# EAGLE design bbb-cc2520_a (EAGLE 6.6.0)
AUTHOR: Neal Jackson; REV: A; TITLE: BBB + CC2520

## Sheet 1 of 2
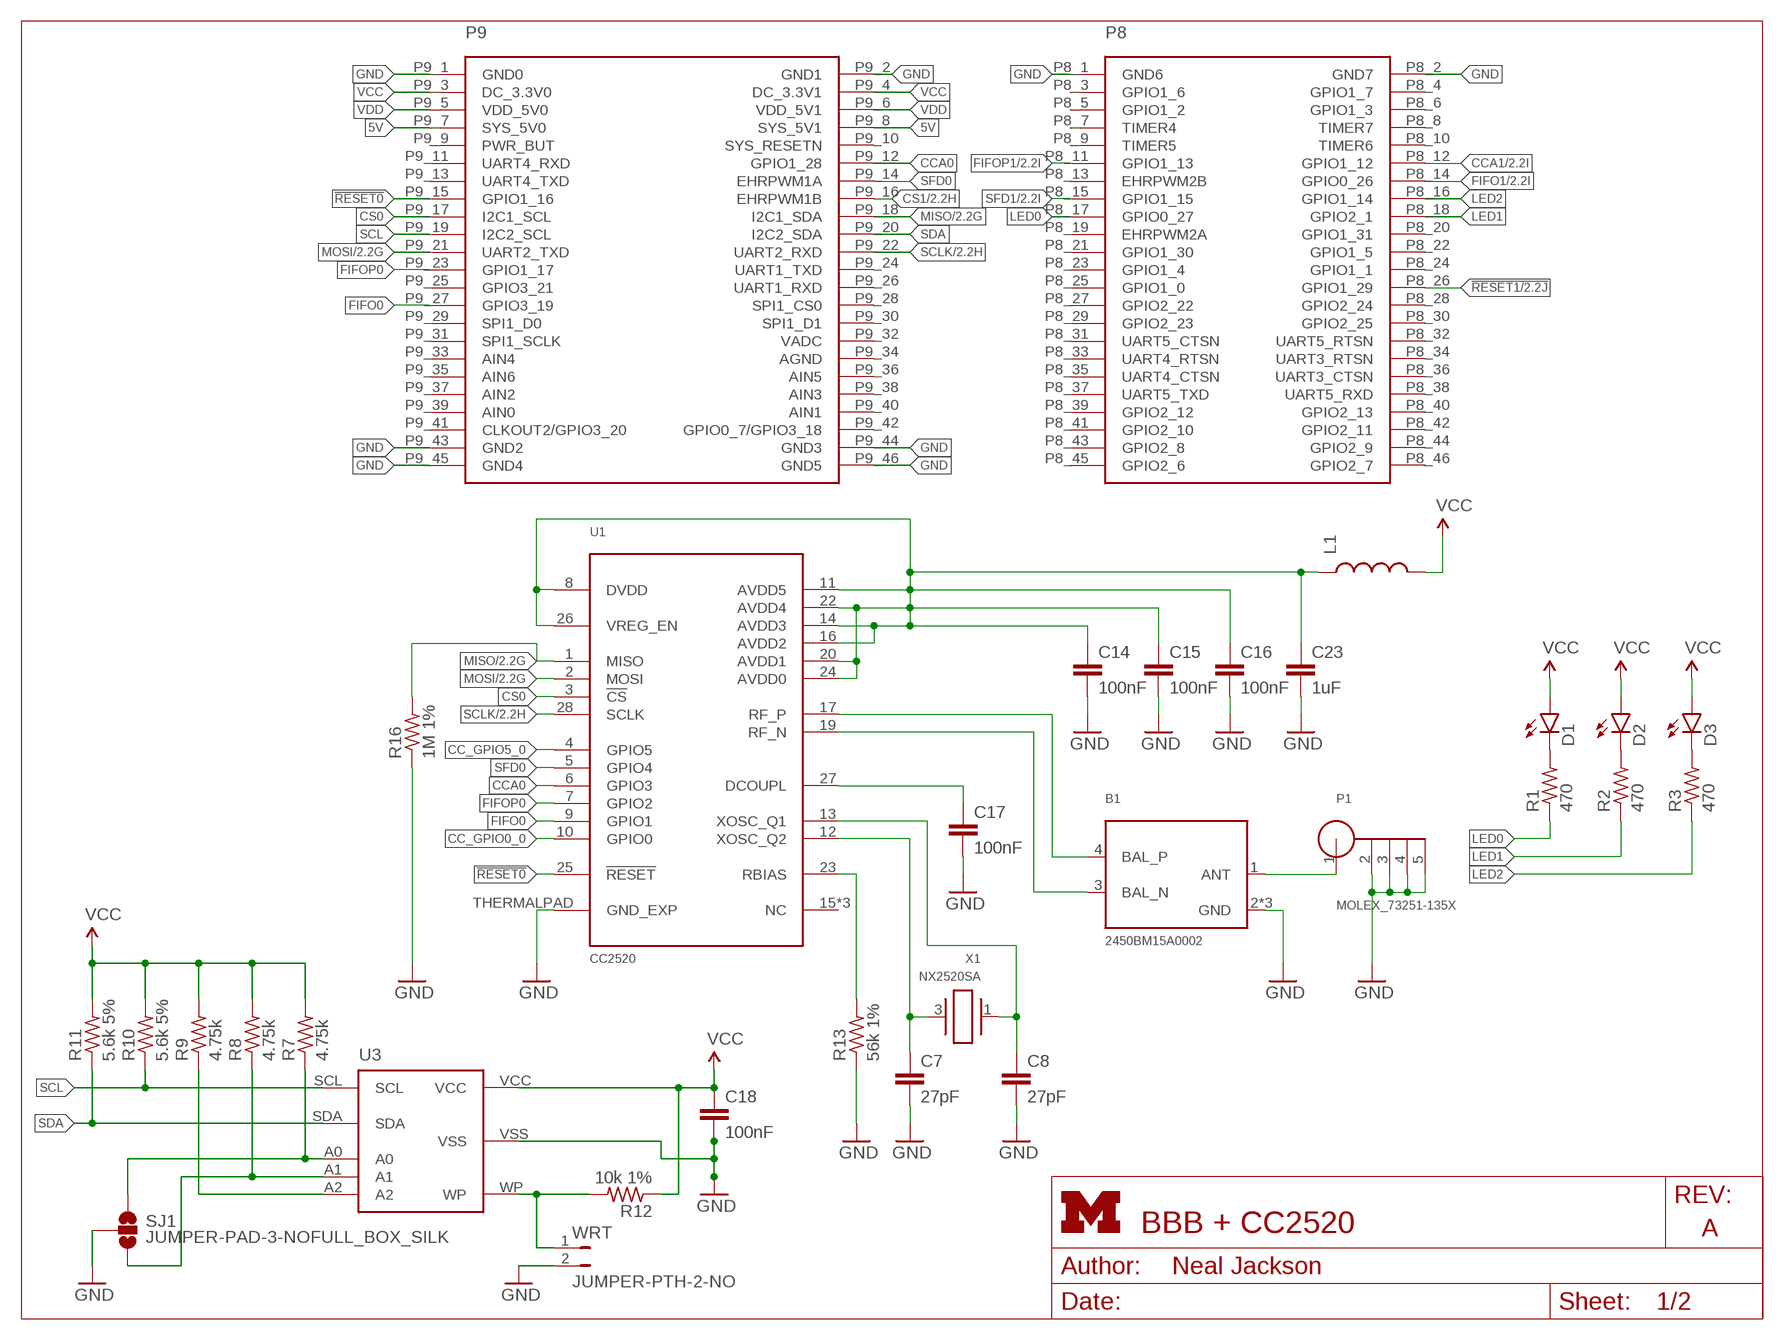
[diagram p0: schematic, sheet 1]
FRAME1 (LETTER_L): HEIGHT: 8.5in; WIDTH: 11in

### Parts
B1  2450BM15A0002  [2450BM]
C7  27pF  C-EUC0402  [C0402]
C8  27pF  C-EUC0402  [C0402]
C14  100nF  C-EUC0402  [C0402]
C15  100nF  C-EUC0402  [C0402]
C16  100nF  C-EUC0402  [C0402]
C17  100nF  C-EUC0402  [C0402]
C18  100nF  C-EUC0402  [C0402]
C23  1uF  C-EUC0603  [C0603]
D1  LED0603  [LED-0603]
D2  LED0603  [LED-0603]
D3  LED0603  [LED-0603]
L1  INDUCTOR0603  [0603]
P1  MOLEX_73251-135X  [SMA-J/PCB]
P9/P8  BBB_HEADERS  [BBB_HEADERS]
R1  470  R-US_R0402  [R0402]
R2  470  R-US_R0402  [R0402]
R3  470  R-US_R0402  [R0402]
R7  4.75k  R-US_R0402  [R0402]
R8  4.75k  R-US_R0402  [R0402]
R9  4.75k  R-US_R0402  [R0402]
R10  5.6k 5%  R-US_R0402  [R0402]
R11  5.6k 5%  R-US_R0402  [R0402]
R12  10k 1%  R-US_R0402  [R0402]
R13  56k 1%  R-US_R0402  [R0402]
R16  1M 1%  R-US_R0402  [R0402]
SJ1  JUMPER-PAD-3-NOFULL_BOX_SILK  [PAD-JUMPER-3-NO_YES_SILK_FULL_BOX]
U1  CC2520  [S-PVQFN-N28]
U3  CAT24C256WI-GT3  [CAT24C256WI-GT3]
WRT  JUMPER-PTH-2-NO  [PTH-JUMPER-2-NO_NO_SILK]
X1  NX2520SA  [NX2520SA]

### Nets
5V: P9/P8.P9_7(SYS_5V0) P9/P8.P9_8(SYS_5V1)
!RESET0: P9/P8.P9_15(GPIO1_16) U1.25(!RESET)
!RESET1: P9/P8.P8_26(GPIO1_29) ; also sheet 2
CC_GPIO0_0: U1.10(GPIO0)
CC_GPIO5_0: U1.4(GPIO5)
CCA0: P9/P8.P9_12(GPIO1_28) U1.6(GPIO3)
CCA1: P9/P8.P8_12(GPIO1_12) ; also sheet 2
CS0: P9/P8.P9_17(I2C1_SCL) U1.3(!CS)
CS1: P9/P8.P9_16(EHRPWM1B) ; also sheet 2
FIFO0: P9/P8.P9_27(GPIO3_19) U1.9(GPIO1)
FIFO1: P9/P8.P8_14(GPIO0_26) ; also sheet 2
FIFOP0: P9/P8.P9_23(GPIO1_17) U1.7(GPIO2)
FIFOP1: P9/P8.P8_11(GPIO1_13) ; also sheet 2
GND: B1.2(GND) B1.5(GND) B1.6(GND) C7.2 C8.2 C14.2 C15.2 C16.2 C17.2 C18.2 C23.2 P1.2 P1.3 P1.4 P1.5 P9/P8.P8_1(GND6) P9/P8.P8_2(GND7) P9/P8.P9_1(GND0) P9/P8.P9_2(GND1) P9/P8.P9_43(GND2) P9/P8.P9_44(GND3) P9/P8.P9_45(GND4) P9/P8.P9_46(GND5) R13.1 R16.1 SJ1.2 U1.THERMALPAD(GND_EXP) U3.VSS WRT.2 ; also sheet 2
LED0: P9/P8.P8_17(GPIO0_27) R1.1
LED1: P9/P8.P8_18(GPIO2_1) R2.1
LED2: P9/P8.P8_16(GPIO1_14) R3.1
MISO: P9/P8.P9_18(I2C1_SDA) R16.2 U1.1(MISO) ; also sheet 2
MOSI: P9/P8.P9_21(UART2_TXD) U1.2(MOSI) ; also sheet 2
N$1: D1.C R1.2
N$2: D2.C R2.2
N$3: D3.C R3.2
N$5: C14.1 C15.1 C16.1 C23.1 L1.1 U1.8(DVDD) U1.11(AVDD5) U1.14(AVDD3) U1.16(AVDD2) U1.20(AVDD1) U1.22(AVDD4) U1.24(AVDD0) U1.26(VREG_EN)
N$7: B1.1(ANT) P1.1
N$11: C8.1 U1.13(XOSC_Q1) X1.1
N$12: C17.1 U1.27(DCOUPL)
N$13: C7.1 U1.12(XOSC_Q2) X1.3
N$14: R13.2 U1.23(RBIAS)
N$29: R7.1 SJ1.1 U3.A0
N$30: R8.1 SJ1.3 U3.A1
N$31: R12.2 U3.WP WRT.1
N$32: R9.1 U3.A2
RF_N: B1.3(BAL_N) U1.19(RF_N)
RF_P: B1.4(BAL_P) U1.17(RF_P)
SCL: P9/P8.P9_19(I2C2_SCL) R10.1 U3.SCL
SCLK: P9/P8.P9_22(UART2_RXD) U1.28(SCLK) ; also sheet 2
SDA: P9/P8.P9_20(I2C2_SDA) R11.1 U3.SDA
SFD0: P9/P8.P9_14(EHRPWM1A) U1.5(GPIO4)
SFD1: P9/P8.P8_15(GPIO1_15) ; also sheet 2
VCC: C18.1 D1.A D2.A D3.A L1.2 P9/P8.P9_3(DC_3.3V0) P9/P8.P9_4(DC_3.3V1) R7.2 R8.2 R9.2 R10.2 R11.2 R12.1 U3.VCC ; also sheet 2
VDD: P9/P8.P9_5(VDD_5V0) P9/P8.P9_6(VDD_5V1)
Unconnected: P9/P8.P8_3(GPIO1_6) P9/P8.P8_4(GPIO1_7) P9/P8.P8_5(GPIO1_2) P9/P8.P8_6(GPIO1_3) P9/P8.P8_7(TIMER4) P9/P8.P8_8(TIMER7) P9/P8.P8_9(TIMER5) P9/P8.P8_10(TIMER6) P9/P8.P8_13(EHRPWM2B) P9/P8.P8_19(EHRPWM2A) P9/P8.P8_20(GPIO1_31) P9/P8.P8_21(GPIO1_30) P9/P8.P8_22(GPIO1_5) P9/P8.P8_23(GPIO1_4) P9/P8.P8_24(GPIO1_1) P9/P8.P8_25(GPIO1_0) P9/P8.P8_27(GPIO2_22) P9/P8.P8_28(GPIO2_24) P9/P8.P8_29(GPIO2_23) P9/P8.P8_30(GPIO2_25) P9/P8.P8_31(UART5_CTSN) P9/P8.P8_32(UART5_RTSN) P9/P8.P8_33(UART4_RTSN) P9/P8.P8_34(UART3_RTSN) P9/P8.P8_35(UART4_CTSN) P9/P8.P8_36(UART3_CTSN) P9/P8.P8_37(UART5_TXD) P9/P8.P8_38(UART5_RXD) P9/P8.P8_39(GPIO2_12) P9/P8.P8_40(GPIO2_13) P9/P8.P8_41(GPIO2_10) P9/P8.P8_42(GPIO2_11) P9/P8.P8_43(GPIO2_8) P9/P8.P8_44(GPIO2_9) P9/P8.P8_45(GPIO2_6) P9/P8.P8_46(GPIO2_7) P9/P8.P9_9(PWR_BUT) P9/P8.P9_10(SYS_RESETN) P9/P8.P9_11(UART4_RXD) P9/P8.P9_13(UART4_TXD) P9/P8.P9_24(UART1_TXD) P9/P8.P9_25(GPIO3_21) P9/P8.P9_26(UART1_RXD) P9/P8.P9_28(SPI1_CS0) P9/P8.P9_29(SPI1_D0) P9/P8.P9_30(SPI1_D1) P9/P8.P9_31(SPI1_SCLK) P9/P8.P9_32(VADC) P9/P8.P9_33(AIN4) P9/P8.P9_34(AGND) P9/P8.P9_35(AIN6) P9/P8.P9_36(AIN5) P9/P8.P9_37(AIN2) P9/P8.P9_38(AIN3) P9/P8.P9_39(AIN0) P9/P8.P9_40(AIN1) P9/P8.P9_41(CLKOUT2/GPIO3_20) P9/P8.P9_42(GPIO0_7/GPIO3_18) U1.15(NC) U1.18(NC) U1.21(NC)

## Sheet 2 of 2
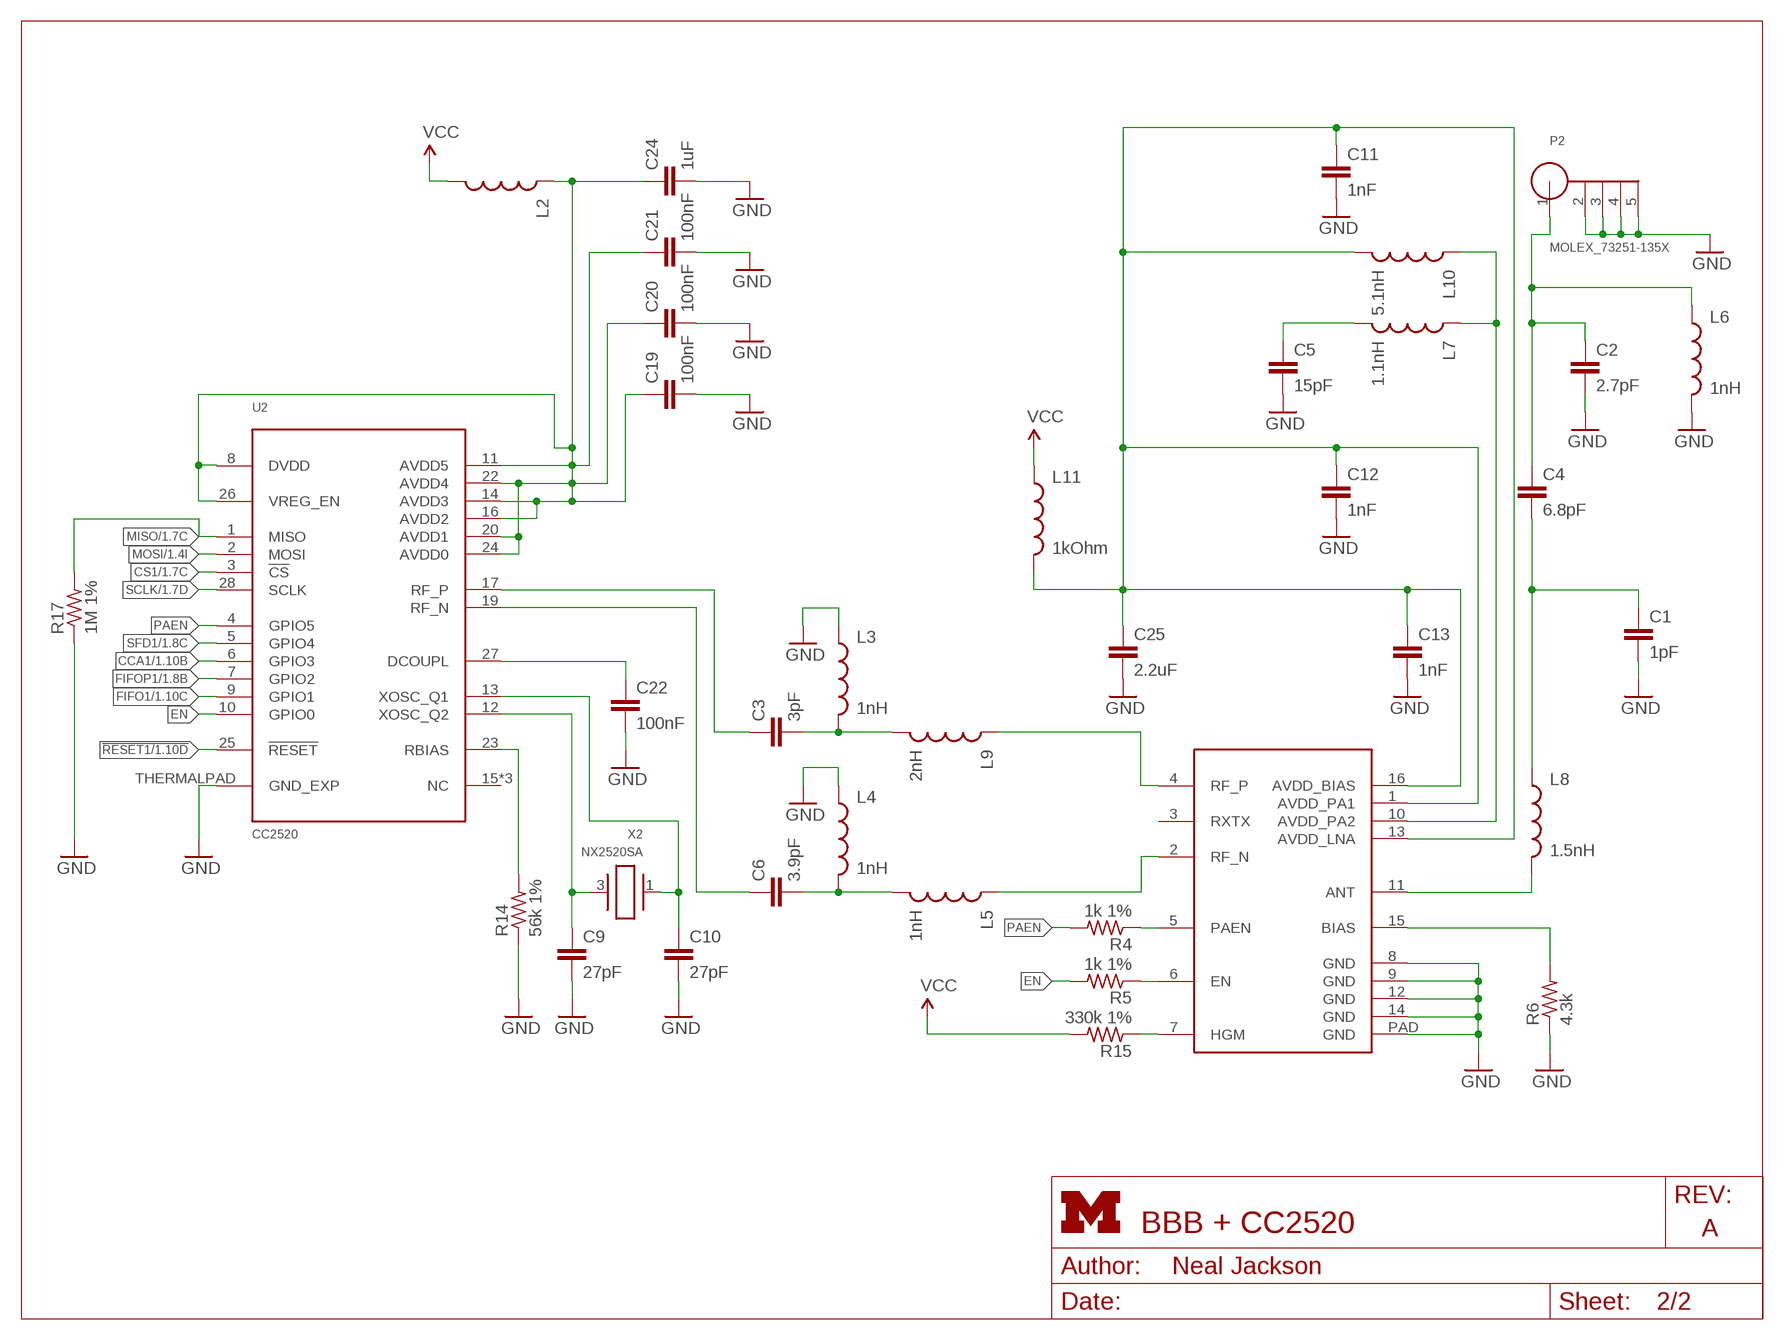
[diagram p1: schematic, sheet 2]
FRAME3 (LETTER_L): HEIGHT: 8.5in; WIDTH: 11in

### Parts
C1  1pF  C-EUC0402  [C0402]
C2  2.7pF  C-EUC0402  [C0402]
C3  3pF  C-EUC0402  [C0402]
C4  6.8pF  C-EUC0402  [C0402]
C5  15pF  C-EUC0402  [C0402]
C6  3.9pF  C-EUC0402  [C0402]
C9  27pF  C-EUC0402  [C0402]
C10  27pF  C-EUC0402  [C0402]
C11  1nF  C-EUC0402  [C0402]
C12  1nF  C-EUC0402  [C0402]
C13  1nF  C-EUC0402  [C0402]
C19  100nF  C-EUC0402  [C0402]
C20  100nF  C-EUC0402  [C0402]
C21  100nF  C-EUC0402  [C0402]
C22  100nF  C-EUC0402  [C0402]
C24  1uF  C-EUC0603  [C0603]
C25  2.2uF  C-EUC0402  [C0402]
L2  INDUCTOR0603  [0603]
L3  1nH  INDUCTOR0402  [C0402]
L4  1nH  INDUCTOR0402  [C0402]
L5  1nH  INDUCTOR0402  [C0402]
L6  1nH  INDUCTOR0402  [C0402]
L7  1.1nH  INDUCTOR0402  [C0402]
L8  1.5nH  INDUCTOR0402  [C0402]
L9  2nH  INDUCTOR0402  [C0402]
L10  5.1nH  INDUCTOR0402  [C0402]
L11  1kOhm  INDUCTOR0402  [C0402]
P2  MOLEX_73251-135X  [SMA-J/PCB]
R4  1k 1%  R-US_R0402  [R0402]
R5  1k 1%  R-US_R0402  [R0402]
R6  4.3k  R-US_R0402  [R0402]
R14  56k 1%  R-US_R0402  [R0402]
R15  330k 1%  R-US_R0402  [R0402]
R17  1M 1%  R-US_R0402  [R0402]
U2  CC2520  [S-PVQFN-N28]
U4  CC2591  [PVQFN-16]
X2  NX2520SA  [NX2520SA]

### Nets
!RESET1: U2.25(!RESET) ; also sheet 1
CCA1: U2.6(GPIO3) ; also sheet 1
CS1: U2.3(!CS) ; also sheet 1
EN: R5.2 U2.10(GPIO0)
FIFO1: U2.9(GPIO1) ; also sheet 1
FIFOP1: U2.7(GPIO2) ; also sheet 1
GND: C1.2 C2.2 C5.2 C9.2 C10.2 C11.2 C12.2 C13.2 C19.2 C20.2 C21.2 C22.2 C24.2 C25.2 L3.1 L4.1 L6.2 P2.2 P2.3 P2.4 P2.5 R6.1 R14.1 R17.1 U2.THERMALPAD(GND_EXP) U4.8(GND) U4.9(GND) U4.12(GND) U4.14(GND) U4.PAD(GND) ; also sheet 1
MISO: R17.2 U2.1(MISO) ; also sheet 1
MOSI: U2.2(MOSI) ; also sheet 1
N$44: L9.1 U4.4(RF_P)
N$45: L5.1 U4.2(RF_N)
N$46: C6.2 L4.2 L5.2
N$47: C3.2 L3.2 L9.2
N$48: L7.1 L10.1 U4.10(AVDD_PA2)
N$49: C11.1 C12.1 C13.1 C25.1 L10.2 L11.2 U4.1(AVDD_PA1) U4.13(AVDD_LNA) U4.16(AVDD_BIAS)
N$50: C5.1 L7.2
N$51: L8.2 U4.11(ANT)
N$52: C2.1 C4.1 L6.1 P2.1
N$53: C1.1 C4.2 L8.1
N$54: R6.2 U4.15(BIAS)
N$55: R4.1 U4.5(PAEN)
N$56: R5.1 U4.6(EN)
N$57: C19.1 C20.1 C21.1 C24.1 L2.1 U2.8(DVDD) U2.11(AVDD5) U2.14(AVDD3) U2.16(AVDD2) U2.20(AVDD1) U2.22(AVDD4) U2.24(AVDD0) U2.26(VREG_EN)
N$58: C22.1 U2.27(DCOUPL)
N$59: C10.1 U2.13(XOSC_Q1) X2.1
N$60: C9.1 U2.12(XOSC_Q2) X2.3
N$61: R14.2 U2.23(RBIAS)
N$62: R15.1 U4.7(HGM)
PAEN: R4.2 U2.4(GPIO5)
RF_N2: C6.1 U2.19(RF_N)
RF_P2: C3.1 U2.17(RF_P)
SCLK: U2.28(SCLK) ; also sheet 1
SFD1: U2.5(GPIO4) ; also sheet 1
VCC: L2.2 L11.1 R15.2 ; also sheet 1
Unconnected: U2.15(NC) U2.18(NC) U2.21(NC) U4.3(RXTX)

## Library data of the parts
B1 = rpi-cc2520:2450BM15A0002: BALUN JTI MATCHED ZIGBEE; DIGIKEY: 712-1536-1-ND
C1-C6 C11-C22 C25 = rcl:C-EU: CAPACITOR, European symbol; DIGIKEY: 490-1318-1-ND
C7-C10 = rcl:C-EU: CAPACITOR, European symbol; DIGIKEY: 490-5869-1-ND
C23 C24 = rcl:C-EU: CAPACITOR, European symbol; DIGIKEY: 490-1550-1-ND
D1 = SparkFun-LED:LED: LEDs Standard schematic elements and footprints for 5mm, 3mm, 1206, and 0603 sized LEDs. 5mm - Spark Fun Electronics SKU : COM-00529 (and others); DIGIKEY: 160-1834-1-ND
D2 = SparkFun-LED:LED: LEDs Standard schematic elements and footprints for 5mm, 3mm, 1206, and 0603 sized LEDs. 5mm - Spark Fun Electronics SKU : COM-00529 (and others); DIGIKEY: 160-1835-1-ND
D3 = SparkFun-LED:LED: LEDs Standard schematic elements and footprints for 5mm, 3mm, 1206, and 0603 sized LEDs. 5mm - Spark Fun Electronics SKU : COM-00529 (and others); DIGIKEY: 160-1837-1-ND
L1 L2 = SparkFun-Passives:INDUCTOR: Inductors Basic Inductor/Choke - 0603 and 1206. Footprints are not proven and vary greatly between part numbers. SRN6045- 33uH, 20% 1.4A SDR0403-560KL - 56uH, 10%, 500mA RMS/740mA peak; DIGIKEY: 490-1015-1-ND
L3-L11 = SparkFun-Passives:INDUCTOR: Inductors Basic Inductor/Choke - 0603 and 1206. Footprints are not proven and vary greatly between part numbers. SRN6045- 33uH, 20% 1.4A SDR0403-560KL - 56uH, 10%, 500mA RMS/740mA peak
P1 P2 = connector:MOLEX_73251-135X: SMA JACK SMT 50 OHM; DIGIKEY: WM9357-ND
P9/P8 = bbb-cc2520:BBB_HEADERS: Pin Header 2x23
R1-R3 = rcl:R-US_: RESISTOR, American symbol; DIGIKEY: RHM470JCT-ND
R4-R6 R13-R15 = rcl:R-US_: RESISTOR, American symbol; DIGIKEY: P56.0KLCT-ND
R7-R12 R16 R17 = rcl:R-US_: RESISTOR, American symbol; DIGIKEY: RHM1.00MCDCT-ND
SJ1 = SparkFun-Passives:JUMPER-PAD-3-NO
U1 U2 = chips:CC2520: 2.4 GHZ IEEE 802.15.4/ZIGBEE® RF TRANSCEIVER; DIGIKEY: 296-22996-1-ND
U3 = bbb-cc2520:CAT24C256: 256kb Serial CMOS EEPROM, organized as 32,768 words of 8 bits each
U4 = bbb-cc2520:CC2591
WRT = SparkFun-Passives:JUMPER-PTH-2-NO
X1 X2 = rpi-cc2520:NX2520SA: CRYSTAL 32MHZ 10PF SMD; DIGIKEY: 644-1065-1-ND

## Board
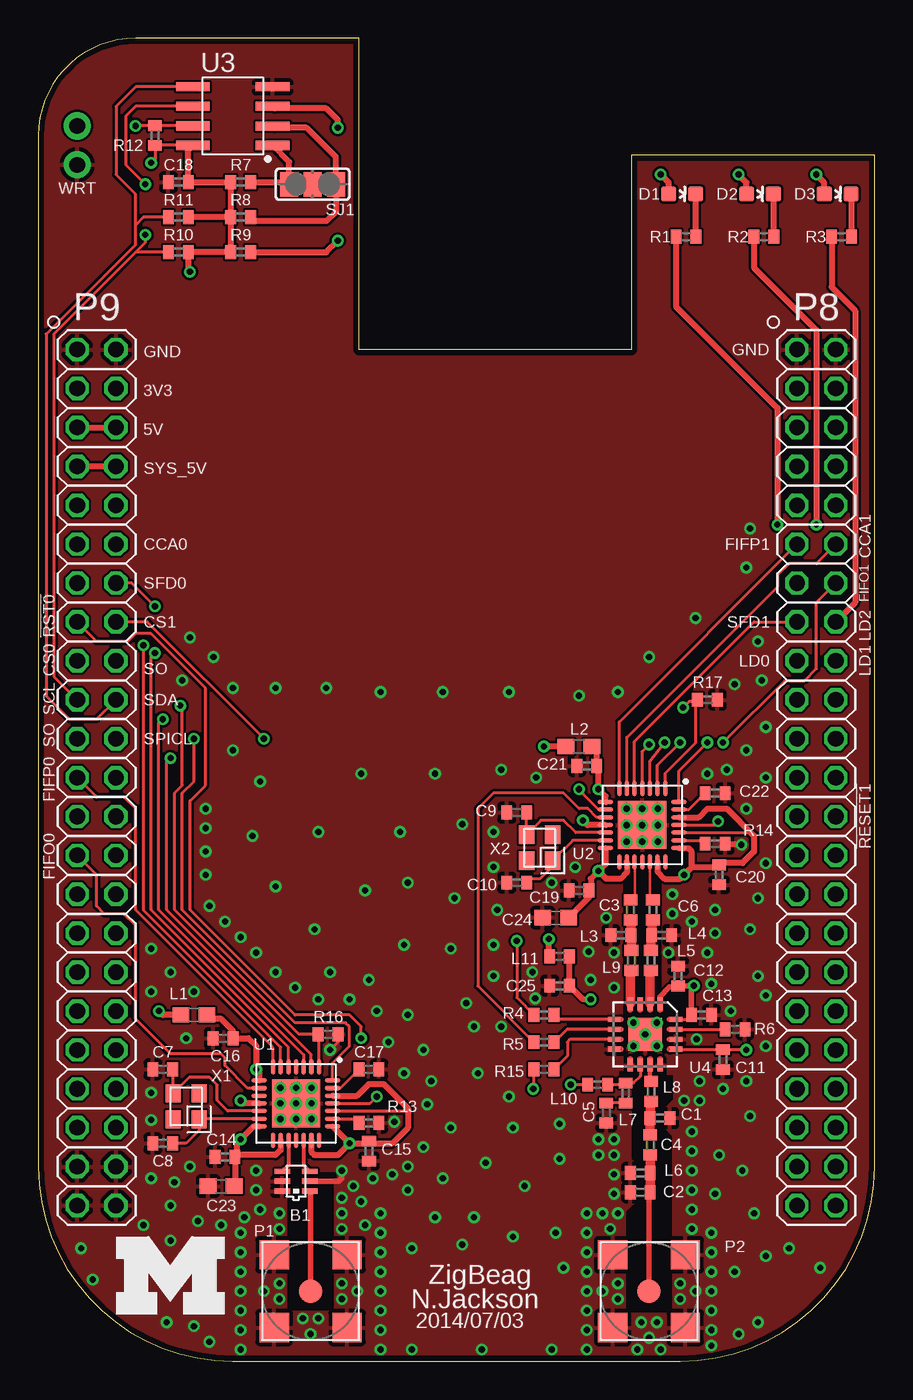
[diagram p2: board, top side]
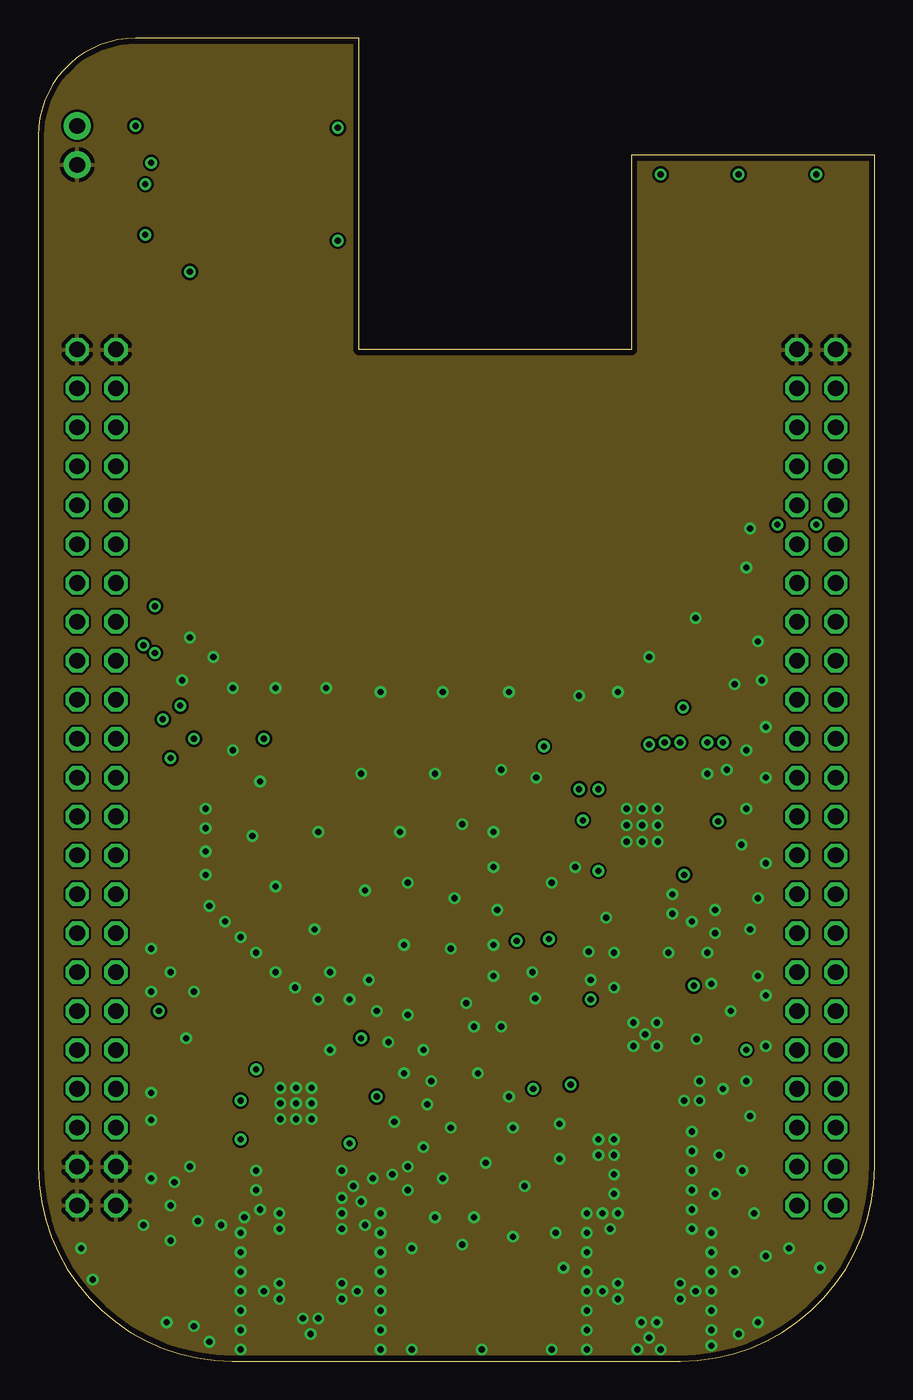
[diagram p3: board, inner layer GND]
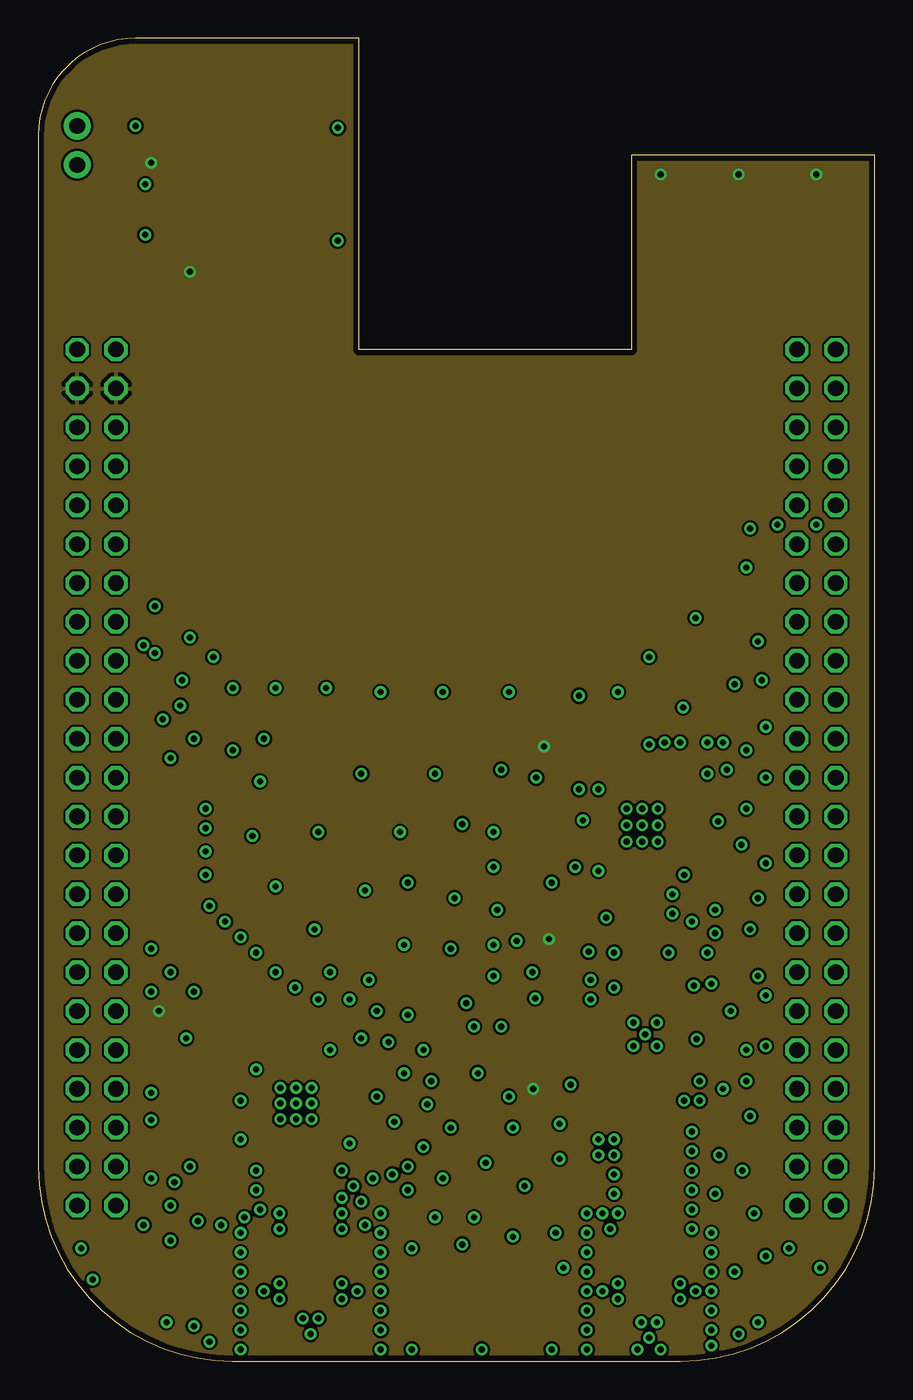
[diagram p4: board, inner layer VCC]
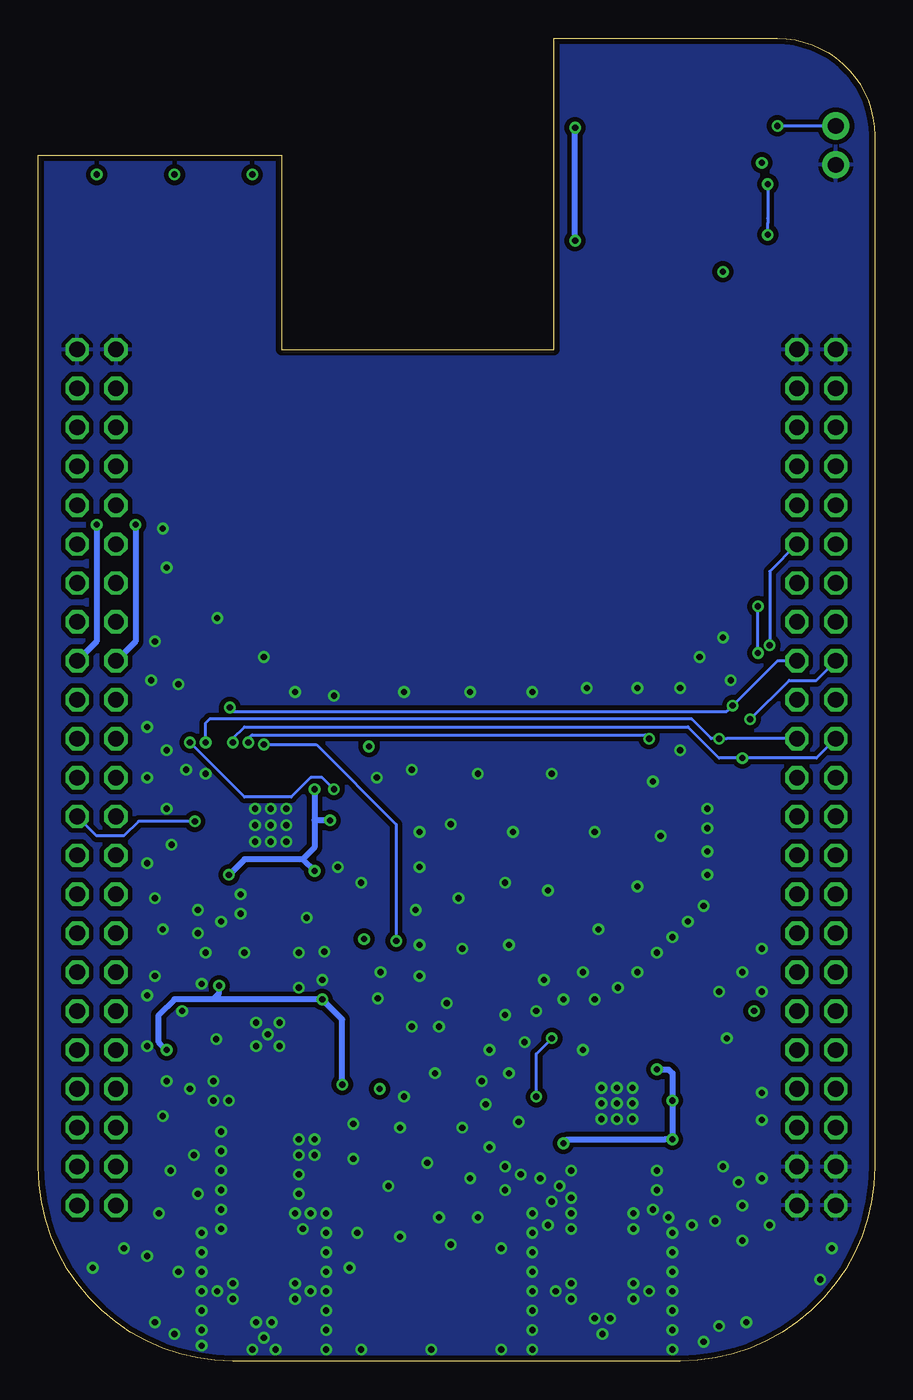
[diagram p5: board, bottom side, seen from below]

Size 54.61 x 86.36 mm. Coordinates in mm from the lower left corner, seen from the top.
Outline: 20.95,86.36 6.35,86.36 arc90 0,80.01 0,12.7 arc90 12.7,0 41.91,0 arc90 54.61,12.7 54.61,78.74 38.73,78.74 38.73,66.04 20.95,66.04 20.95,86.36
Copper layers (1+2*15+16): Top 0.035559375mm / dielectric 0.17018125mm / GND 0.01778125mm / dielectric 47mil / VCC 0.01778125mm / dielectric 0.17018125mm / Bottom 0.035559375mm
Design rules "OSHPCBOrder *": minimum track width 6mil, minimum drill 13mil, track to track 6mil, track to pad 6mil, pad to pad 6mil, via to via 6mil, smd to smd 6mil, copper to edge 15mil, drill to drill 6mil, minimum pad ring 7mil, minimum via ring 7mil, stop-mask expansion 3mil, vias tented up to drill 30mil, thermal gap 10mil

### Footprints (pad centres in the part's own frame; a part is rotated, then mirrored left to right if it is on the bottom)
2450BM = smd 0.35 x 1: 1 0.65,0.9; 2 0,0.9; 3 -0.65,0.9; 4 -0.65,-0.9; 5 0,-0.9; 6 0.65,-0.9
C0402 = smd 0.7 x 0.9: 1 -0.65,0; 2 0.65,0
C0603 = smd 1.1 x 1: 1 -0.85,0; 2 0.85,0
LED-0603 = smd 1 x 1: A 0,-0.877; C 0,0.877
0603 = smd 1.1 x 1: 1 -0.85,0; 2 0.85,0
SMA-J/PCB = smd 1.52 x 1.52: 1 0,0 | smd 1.91 x 1.91: 2 -2.375,-2.375; 3 2.375,-2.375; 4 2.375,2.375; 5 -2.375,2.375
BBB_HEADERS = drill 1.016 octagon: P8_1 48.26,57.15; P8_2 50.8,57.15; P8_3 48.26,54.61; P8_4 50.8,54.61; P8_5 48.26,52.07; P8_6 50.8,52.07; P8_7 48.26,49.53; P8_8 50.8,49.53; P8_9 48.26,46.99; P8_10 50.8,46.99; P8_11 48.26,44.45; P8_12 50.8,44.45; P8_13 48.26,41.91; P8_14 50.8,41.91; P8_15 48.26,39.37; P8_16 50.8,39.37; P8_17 48.26,36.83; P8_18 50.8,36.83; P8_19 48.26,34.29; P8_20 50.8,34.29; P8_21 48.26,31.75; P8_22 50.8,31.75; P8_23 48.26,29.21; P8_24 50.8,29.21; P8_25 48.26,26.67; P8_26 50.8,26.67; P8_27 48.26,24.13; P8_28 50.8,24.13; P8_29 48.26,21.59; P8_30 50.8,21.59; P8_31 48.26,19.05; P8_32 50.8,19.05; P8_33 48.26,16.51; P8_34 50.8,16.51; P8_35 48.26,13.97; P8_36 50.8,13.97; P8_37 48.26,11.43; P8_38 50.8,11.43; P8_39 48.26,8.89; P8_40 50.8,8.89; P8_41 48.26,6.35; P8_42 50.8,6.35; P8_43 48.26,3.81; P8_44 50.8,3.81; P8_45 48.26,1.27; P8_46 50.8,1.27; P9_1 1.27,57.15; P9_2 3.81,57.15; P9_3 1.27,54.61; P9_4 3.81,54.61; P9_5 1.27,52.07; P9_6 3.81,52.07; P9_7 1.27,49.53; P9_8 3.81,49.53; P9_9 1.27,46.99; P9_10 3.81,46.99; P9_11 1.27,44.45; P9_12 3.81,44.45; P9_13 1.27,41.91; P9_14 3.81,41.91; P9_15 1.27,39.37; P9_16 3.81,39.37; P9_17 1.27,36.83; P9_18 3.81,36.83; P9_19 1.27,34.29; P9_20 3.81,34.29; P9_21 1.27,31.75; P9_22 3.81,31.75; P9_23 1.27,29.21; P9_24 3.81,29.21; P9_25 1.27,26.67; P9_26 3.81,26.67; P9_27 1.27,24.13; P9_28 3.81,24.13; P9_29 1.27,21.59; P9_30 3.81,21.59; P9_31 1.27,19.05; P9_32 3.81,19.05; P9_33 1.27,16.51; P9_34 3.81,16.51; P9_35 1.27,13.97; P9_36 3.81,13.97; P9_37 1.27,11.43; P9_38 3.81,11.43; P9_39 1.27,8.89; P9_40 3.81,8.89; P9_41 1.27,6.35; P9_42 3.81,6.35; P9_43 1.27,3.81; P9_44 3.81,3.81; P9_45 1.27,1.27; P9_46 3.81,1.27
R0402 = smd 0.7 x 0.9: 1 -0.65,0; 2 0.65,0
PAD-JUMPER-3-NO_YES_SILK_FULL_BOX = smd 1.168 x 1.6: 1 -1.524,0; 2 0,0; 3 1.524,0
S-PVQFN-N28 = smd 1 x 0.28: 1 -2.4,1.5; 2 -2.4,1; 3 -2.4,0.5; 4 -2.4,0; 5 -2.4,-0.5; 6 -2.4,-1; 7 -2.4,-1.5; 15 2.4,-1.5; 16 2.4,-1; 17 2.4,-0.5; 18 2.4,0; 19 2.4,0.5; 20 2.4,1; 21 2.4,1.5 | smd 0.28 x 1: 8 -1.5,-2.4; 9 -1,-2.4; 10 -0.5,-2.4; 11 0,-2.4; 12 0.5,-2.4; 13 1,-2.4; 14 1.5,-2.4; 22 1.5,2.4; 23 1,2.4; 24 0.5,2.4; 25 0,2.4; 26 -0.5,2.4; 27 -1,2.4; 28 -1.5,2.4 | smd 3.15 x 3.15: THERMALPAD 0,0
CAT24C256WI-GT3 = smd 2.2 x 0.6: A0 -2.6,1.91; A1 -2.6,0.65; A2 -2.6,-0.64; SCL 2.6,-0.64; SDA 2.6,-1.91; VCC 2.6,1.91; VSS -2.6,-1.91; WP 2.6,0.64
PVQFN-16 = smd 0.35 x 0.825: 1 -0.975,-2.013; 2 -0.325,-2.013; 3 0.325,-2.013; 4 0.975,-2.013; 9 0.975,2.013; 10 0.325,2.013; 11 -0.325,2.013; 12 -0.975,2.013 | smd 0.825 x 0.35: 5 2.013,-0.975; 6 2.013,-0.325; 7 2.013,0.325; 8 2.013,0.975; 13 -2.013,0.975; 14 -2.013,0.325; 15 -2.013,-0.325; 16 -2.013,-0.975 | smd 2.16 x 2.16: PAD 0,0
PTH-JUMPER-2-NO_NO_SILK = drill 1.016 pad 1.778: 1 -1.27,0; 2 1.27,0
NX2520SA = smd 1.2 x 1: 1 -0.85,-0.85; 2 0.85,-0.85; 3 0.85,0.85; 4 -0.85,0.85

### Placement (x,y rotation side)
B1  16.83,11.75 270 top
C1  40.59,15.88 0 top
C2  39.31,11.02 180 top
C3  38.67,29.46 270 top
C4  39.95,14.12 90 top
C5  37.08,16.21 270 top
C6  40.13,29.46 270 top
C7  8.13,19.05 180 top
C8  8.13,14.22 180 top
C9  31.24,35.81 180 top
C10  31.24,31.24 180 top
C11  44.7,19.68 270 top
C12  41.77,25.15 90 top
C13  43.31,22.61 0 top
C14  12.19,13.34 180 top
C15  21.59,13.72 270 top
C16  12.06,21.08 180 top
C17  21.59,19.05 0 top
C18  9.14,76.96 180 top
C19  35.31,30.73 180 top
C20  44.45,31.75 270 top
C21  35.81,38.86 180 top
C22  44.2,37.08 0 top
C23  11.94,11.43 180 top
C24  33.78,28.96 180 top
C25  34.04,24.51 180 top
D1  42.04,76.2 270 top
D2  47.12,76.2 270 top
D3  52.2,76.2 270 top
L1  10.16,22.61 180 top
L2  35.31,40.13 180 top
L3  38.04,27.81 0 top
L4  40.7,27.81 180 top
L5  40.01,26.16 90 top
L6  39.31,12.29 180 top
L7  38.35,17.5 270 top
L8  40.02,17.61 90 top
L9  38.73,26.16 90 top
L10  36.53,18.06 180 top
L11  34.04,26.42 0 top
P1  17.78,4.57 270 top
P2  39.88,4.57 0 top
P9/P8  1.27,8.89 0 top
R1  42.29,73.41 0 top
R2  47.37,73.41 0 top
R3  52.45,73.41 0 top
R4  33.02,22.61 180 top
R5  33.02,20.83 180 top
R6  45.49,21.67 180 top
R7  13.21,76.96 180 top
R8  13.21,74.68 180 top
R9  13.21,72.39 180 top
R10  9.14,72.39 0 top
R11  9.14,74.68 0 top
R12  7.62,80.01 90 top
R13  21.59,15.56 180 top
R14  44.2,33.78 180 top
R15  33.02,19.05 180 top
R16  18.92,21.34 180 top
R17  43.69,43.18 180 top
SJ1  17.91,76.83 0 top
U1  16.83,16.83 270 top
U2  39.43,35 270 top
U3  12.7,81.28 180 top
U4  39.62,21.34 180 top
U$2  [UMICH_SOLID_200MIL]  5.08,3.05 0 top
WRT  2.54,79.38 270 top
X1  9.65,16.64 90 top
X2  32.73,33.53 90 top

### Tracks (layer width: path | path; a pad name or v marks a point on that pad's centre or on a via)
5V
  Top 0.406: P9/P8.P9_7 P9/P8.P9_8
!RESET0  (via drill 0.41)
  Top 0.203: v22.1,17.27 21.65,16.83 U1.25 | P9/P8.P9_15 3.81,46.99 5.84,46.99 6.35,47.5 7.37,47.5 10.92,43.94 10.92,37.59 9.91,36.58 9.91,29.46 16.76,22.61 20.32,22.61 21.08,21.84 v21.08,21.08
  Bottom 0.203: v22.1,17.27 22.1,20.07 v21.08,21.08
!RESET1  (via drill 0.41)
  Top 0.203: U2.25 44.15,35 v44.39,35.24
  Bottom 0.203: P9/P8.P8_26 50.8,34.29 49.02,34.29 48.07,35.24 v44.39,35.24
CCA0  (via drill 0.41)
  Top 0.203: U1.6 15.83,20.49 6.86,29.46 v6.86,46.74
  Bottom 0.203: v6.86,46.74 6.86,51.56 P9/P8.P9_12
CCA1
  Top 0.203: U2.6 38.43,40.72 48.26,50.55 48.26,51.31 49.02,52.07 50.8,52.07 P9/P8.P8_12
CS0  (via drill 0.41)
  Top 0.203: U1.3 17.33,20.01 7.87,29.46 7.87,41.66 v8.13,41.91
  Bottom 0.203: v8.13,41.91 5.59,44.45 3.81,44.45 P9/P8.P9_17
CS1  (via drill 0.41)
  Top 0.203: v14.73,40.64 7.11,48.26 P9/P8.P9_16 | U2.3 39.93,39.17 v40.89,40.39
  Bottom 0.203: v40.89,40.39 40.89,40.64 40.64,40.89 14.99,40.89 v14.73,40.64
EN
  Top 0.203: R5.2 28.7,24.5 28.7,36.07 29.72,37.08 34.29,37.08 35.31,36.07 35.88,36.07 36.44,35.5 U2.10
FIFO0
  Top 0.203: U1.9 13.67,17.83 12.19,19.3 12.19,19.81 11.94,20.07 8.64,20.07 6.35,22.35 6.35,28.45 5.59,29.21 4.32,29.21 3.81,29.72 3.81,31.75 P9/P8.P9_27
FIFO1  (via drill 0.41)
  Top 0.203: P9/P8.P8_14 50.8,49.53 50.8,45.21 50.04,44.45 48.77,44.45 v44.7,40.39 | U2.9 36.58,36 35.31,37.27 v35.31,37.34
  Bottom 0.203: v44.7,40.39 41.15,36.83 38.1,36.83 36.83,38.1 36.07,38.1 v35.31,37.34
FIFOP0
  Top 0.203: U1.7 15.33,20.49 6.35,29.46 6.35,36.07 5.59,36.83 3.81,36.83 P9/P8.P9_23
FIFOP1
  Top 0.203: U2.7 37.93,41.74 P9/P8.P8_11
GND  (via drill 0.41)
  Top 0.203: R16.1 19.57,20.84 v19.05,20.32
  Top 0.356: B1.2 19.62,11.75 19.81,11.94 v19.81,12.45
  Top 0.406: U4.PAD 39.62,22.1 | R14.1 45.85,33.78 v45.91,33.72
  other vias: 23.24,15.62 42.99,21.02 9.65,21.08 10.16,24.13 7.37,24.13 8.64,25.4 7.37,26.92 9.91,12.7 8.89,11.68 7.37,11.94 7.37,15.75 7.37,17.53 10.41,9.14 8.64,10.16 13.21,7.11 15.75,9.65 15.75,8.64 19.81,9.65 19.81,10.67 19.81,8.64 19.81,5.08 19.81,4.06 17.27,2.79 18.29,2.79 15.75,5.08 15.75,4.06 14.73,4.57 17.78,1.78 20.83,4.57 14.22,12.45 14.22,11.18 13.46,9.4 13.21,8.38 13.21,5.84 13.21,4.57 13.21,3.3 13.21,2.03 13.21,0.76 22.35,0.76 22.35,2.03 22.35,3.3 22.35,4.57 22.35,5.84 22.35,7.11 22.35,8.38 14.48,9.91 21.34,8.89 22.35,9.65 21.84,11.94 21.08,10.41 20.57,11.43 8.38,2.54 3.56,5.33 2.79,7.37 11.18,1.27 11.18,29.72 12.19,28.7 13.21,27.69 14.22,26.67 15.49,25.4 16.76,24.38 18.29,23.62 20.32,23.62 22.1,22.86 22.86,20.83 23.88,18.8 25.4,16.76 25.15,13.97 24.13,12.7 19.05,25.4 21.59,24.89 24.13,22.61 25.15,20.32 25.65,18.29 26.92,15.24 26.42,11.94 24.13,11.18 23.11,12.19 11.94,8.89 6.86,8.89 10.92,36.07 10.92,34.8 10.92,33.27 10.92,31.75 31.75,11.43 28.45,9.4 33.78,8.38 24.38,7.37 34.29,6.1 24.38,0.76 33.53,0.76 39.12,0.76 40.64,0.76 35.81,0.76 35.81,2.03 35.81,4.57 35.81,5.84 35.81,7.11 35.81,8.38 37.85,9.65 43.94,8.38 37.85,5.08 37.85,4.06 36.83,4.57 39.37,2.54 40.39,2.54 39.88,1.52 42.67,8.64 42.93,4.57 41.91,5.08 41.91,4.06 43.94,4.57 43.94,5.84 43.94,7.11 43.94,3.3 43.94,2.03 43.94,1.02 35.81,3.3 37.34,8.64 42.67,9.91 42.67,11.18 42.67,12.45 42.67,13.72 42.67,14.99 42.16,17.02 43.18,17.02 43.18,18.29 37.59,10.92 37.59,12.19 37.59,13.46 37.59,14.48 36.58,14.48 30.99,15.24 34.04,15.49 34.04,13.21 44.2,10.92 44.45,13.46 46.48,16 45.97,12.45 46.74,9.65 49.02,7.37 45.47,5.84 46.99,2.54 51.05,6.1 45.72,1.78 28.96,0.76 30.99,8.13 25.91,9.4 35.81,9.65 36.83,9.65 36.58,13.46 47.5,6.86 30.73,17.27 30.23,21.84 28.7,18.8 28.45,21.84 27.94,23.37 29.72,25.15 29.97,29.46 29.72,34.54 27.69,35.05 27.18,30.23 21.34,30.73 15.49,30.99 18.29,34.54 23.62,34.54 23.88,27.18 18.03,28.19 14.48,37.85 21.08,38.35 25.91,38.35 30.23,38.61 32.51,38.1 43.94,24.64 45.21,22.86 47.5,23.88 46.23,18.29 44.7,17.78 41.15,26.67 44.2,29.46 41.4,30.48 41.4,29.21 42.67,28.7 43.69,26.67 47.5,20.57 37.59,24.38 36.07,24.89 37.59,26.67 35.94,26.73 35.05,32.26 37.08,28.96 12.7,39.88 9.4,44.45 9.91,47.24 11.43,45.97 12.7,43.94 15.49,43.94 18.8,43.94 22.35,43.69 26.42,43.69 30.73,43.69 35.31,43.43 37.85,43.69 39.88,45.97 47.24,44.45 45.47,44.2 42.93,48.51 46.23,51.82 46.48,54.36 46.99,46.99 47.5,41.4 46.23,39.88 47.5,38.1 46.23,36.07 46.99,30.23 47.5,32.51 46.48,28.19 46.99,25.15 29.21,12.95 16.83,16.83 17.84,16.83 17.84,17.84 16.83,17.84 15.81,17.84 15.81,16.83 15.81,15.81 16.83,15.81 17.84,15.81 39.62,21.34 38.86,22.1 40.39,22.1 38.86,20.57 40.39,20.57 38.42,36.07 39.43,36.07 40.45,36.07 38.42,34.99 39.43,34.99 40.45,34.99 38.42,33.91 39.43,33.91 40.45,33.91 8.64,7.87 10.16,2.29 27.69,7.62 26.92,26.92 24.13,31.24 13.97,34.29 29.72,32.26 33.53,31.24 29.72,27.18 43.69,38.35 44.96,38.61 44.2,27.94 32.26,25.4 32.45,23.69
  pour Bottom (isolate 0.305): 0,86.36 54.61,86.36 54.61,0 0,0
  pour Top: 54.61,86.36 0,86.36 0,0.02 5.2,0 16,0 16,12.45 19.56,12.45 19.6,0 38.1,0 38.1,9.65 38.86,10.41 38.86,12.83 38.35,13.46 38.35,18.54 37.85,18.54 37.85,32.77 40.89,32.77 40.89,18.8 41.66,18.8 41.66,17.08 41.08,16.51 41.08,15.24 41.15,15.18 41.91,14.48 41.91,0 54.61,0
  pour GND: 0,0 54.61,0 54.61,86.36 0,86.36
  pour Top: 19.3,11.94 19.3,3.3 16.26,3.3 16.26,11.94 14.48,11.94 14.48,0 21.08,0 21.08,11.94
  pour Top: 36.32,0 36.32,18.54 38.73,18.54 38.73,13.21 38.99,12.95 38.99,10.35 38.35,9.78 38.35,0
  pour Top: 41.4,0 41.4,14.67 40.89,15.24 40.89,16.51 41.47,17.08 41.47,18.8 45.47,18.8 45.47,0
  pour Top: 38.1,0 41.91,0 41.91,3.05 38.1,3.05
  pour Top: 36.83,19.05 41.91,19.05 41.91,20.83 36.83,20.83
  pour Top: 38.16,22.61 38.16,32 36.83,32 36.83,22.61 38.1,22.61
  pour Top: 40.7,32 40.7,22.61 41.91,22.61 41.91,32
  pour Top: 15.75,0 15.75,3.05 19.81,3.05 19.81,0
LED0  (via drill 0.41)
  Top 0.406: v48.26,54.61 48.26,62.23 41.64,68.85 R1.1
  Bottom 0.406: v48.26,54.61 48.26,46.99 P9/P8.P8_17
LED1  (via drill 0.41)
  Top 0.406: v50.8,54.61 50.8,67.31 46.72,71.39 R2.1
  Bottom 0.406: v50.8,54.61 50.8,46.99 P9/P8.P8_18
LED2
  Top 0.406: P9/P8.P8_16 53.34,49.53 53.34,68.58 51.8,70.12 R3.1
MISO  (via drill 0.41)
  Top 0.203: U1.1 18.33,21.28 R16.2 17.02,21.34 8.89,29.46 8.89,37.08 9.4,37.59 9.4,42.67 v9.27,42.8 | U2.1 40.93,38.39 42.93,40.39 42.93,43.07 | 42.93,43.07 R17.2 | 42.93,43.07 42.5,43.07 v42.1,42.67
  Bottom 0.203: P9/P8.P9_18 6.35,45.72 v9.27,42.8 9.65,42.42 41.85,42.42 v42.1,42.67
MOSI  (via drill 0.41)
  Top 0.203: U1.2 17.83,20.02 8.38,29.46 8.38,39.12 v8.64,39.37 | U2.2 40.43,38.91 v41.91,40.39
  Bottom 0.203: P9/P8.P9_21 3.81,39.37 v8.64,39.37 10.16,39.37 12.19,41.4 41.15,41.4 41.91,40.64 v41.91,40.39
N$1
  Top 0.406: D1.C 42.91,73.43 R1.2
N$2
  Top 0.406: D2.C 47.99,73.43 R2.2
N$3
  Top 0.406: D3.C 53.07,73.43 R3.2
N$5  (via drill 0.41)
  Top 0.203: U1.24 23.95,16.33 24.13,16.51
  Top 0.406: U1.26 20.82,17.33 21.59,18.1 22.54,18.1 24.13,16.51 24.13,15.24 23.11,14.22 21.34,14.22 | U1.20 17.83,13.67 18.03,13.46 19.56,13.46 v20.32,14.22 | U1.22 19.23,15.32 v20.32,14.22 | v20.32,14.22 21.34,14.22 | 21.34,14.22 21.48,14.37 C15.1 21.45,14.22 v20.32,14.22 | U1.16 15.83,13.8 15.49,13.46 12.97,13.46 | 12.97,13.46 C14.1 12.84,11.48 C23.1 | U1.11 13.4,16.83 v13.21,17.02 | U1.8 14.43,18.85 v14.22,19.05 14.22,20.57 13.72,21.08 C16.1 12.71,21.57 11.94,22.35 11.26,22.35 L1.1 | U1.14 14.06,15.33 v13.21,14.48 12.97,14.24 12.97,13.46
  Bottom 0.406: v20.32,14.22 20.07,14.48 13.72,14.48 v13.21,14.48 v13.21,17.02 13.21,18.8 13.46,19.05 v14.22,19.05
N$7
  Top 0.356: P1.1 17.78,11.04 B1.1
N$11
  Top 0.203: U1.13 10.54,15.83 X1.1 10.5,15.07 9.65,14.22 C8.1
N$12
  Top 0.203: U1.27 19.72,17.83 C17.1
N$13
  Top 0.203: U1.12 12.37,16.33 11.68,17.02 11.68,18.03 11.18,18.54 9.86,18.54 X1.3 8.78,17.51 C7.1
N$14
  Top 0.203: U1.23 20.67,15.83 R13.2
N$29
  Top 0.406: R7.1 16.26,76.96 SJ1.1 16.38,78.29 U3.A0
N$30
  Top 0.406: R8.1 14.11,74.42 18.8,74.42 19.43,75.06 SJ1.3 19.43,78.61 17.53,80.52 15.41,80.52 U3.A1
N$31  (via drill 0.41)
  Top 0.203: U3.WP 7.64,80.64 R12.2 6.37,80.66 v6.35,80.64
  Bottom 0.203: v6.35,80.64 WRT.1
N$32  (via drill 0.41)
  Top 0.406: R9.1 18.8,72.39 v19.56,73.15 | v19.56,80.52 19.56,81.03 18.8,81.79 15.43,81.79 U3.A2
  Bottom 0.406: v19.56,73.15 v19.56,80.52
N$44
  Top 0.61: U4.4 38.65,25.49 L9.1
N$45
  Top 0.61: U4.2 39.95,25.46 L5.1
N$46
  Top 0.61: L5.2 40.01,27.77 L4.2 40.05,28.73 C6.2
N$47
  Top 0.61: L9.2 38.73,27.77 L3.2 38.69,28.8 C3.2
N$48
  Top 0.203: L10.1 38.26,18.06 L7.1 38.36,18.16 38.86,18.16 39.3,18.6 U4.10
N$49  (via drill 0.41)
  Top 0.203: U4.13 44.68,20.36 C11.1 44.73,20.36 46.19,20.36 v46.23,20.32 | C13.1 42.36,22.31 U4.16 42.63,22.31 42.67,22.35 | v34.76,18.06 L10.2
  Top 0.356: U4.1 40.6,23.77 41.21,24.45 41.72,24.45 C12.1 42.56,24.5 v42.8,24.51 42.66,24.37 C13.1 | v36.07,23.62 35.58,23.62 C25.1
  Top 0.406: C25.1 L11.2
  Bottom 0.356: v42.8,24.51 42.8,24 43.18,23.62
  Bottom 0.406: v46.23,20.32 46.74,20.83 46.74,22.61 45.72,23.62 43.18,23.62 v36.07,23.62 34.76,22.31 v34.76,18.06
N$50
  Top 0.203: L7.2 C5.1
N$51
  Top 0.305: 39.95,18.33 L8.2 39.95,18.4 U4.11
N$52
  Top 0.356: P2.1 39.88,10.95 C2.1
  Top 0.61: C4.1 L6.1 C2.1 39.94,11.01
N$53
  Top 0.61: 39.94,14.78 C4.2 39.94,14.79 C1.1 39.95,15.89 39.95,16.96 L8.1
N$54
  Top 0.203: U4.15 R6.2
N$55
  Top 0.203: U4.5 33.97,22.31 R4.1
N$56
  Top 0.203: U4.6 34.5,21.66 R5.1
N$57  (via drill 0.41)
  Top 0.203: U2.24 46.52,34.5 46.74,34.29
  Top 0.406: U2.20 40.43,31.96 40.89,31.5 41.91,31.5 v42.16,31.75 42.67,32.26 | U2.22 42.44,33.5 42.67,33.27 42.67,32.26 | 42.67,32.26 44.31,32.26 C20.1 44.56,32.51 45.97,32.51 46.74,33.27 46.74,34.29 44.96,36.07 43.69,36.07 43.12,35.5 U2.26 | U2.11 35.86,35 v35.56,35.31 | L2.1 36.46,39.82 C21.1 36.58,38.75 v36.58,37.34 37.03,36.88 U2.8 | v36.58,32 36.07,31.5 36.07,30.85 C19.1 35.96,30.28 C24.1 | U2.14 37.03,32.46 v36.58,32 | v36.58,32 37.08,31.5 38.04,31.5 38.43,31.89 U2.16
  Bottom 0.406: v42.16,31.75 41.15,32.77 37.34,32.77 | v36.58,37.34 36.58,35.31 | 36.58,35.31 36.58,33.53 37.34,32.77 | v35.56,35.31 36.58,35.31 | 37.34,32.77 v36.58,32
N$58
  Top 0.203: U2.27 42.46,36 C22.1
N$59
  Top 0.203: U2.13 34.91,34 X2.1 33.58,32.31 32.77,31.5 32.15,31.5 C10.1
N$60
  Top 0.203: U2.12 35.09,34.5 34.29,35.31 32.81,35.31 X2.3 C9.1
N$61
  Top 0.203: U2.23 43.26,34 R14.2
N$62
  Top 0.203: U4.7 34.73,21.01 34.54,20.83 34.54,19.92 R15.1
PAEN  (via drill 0.41)
  Top 0.203: v31.24,27.43 31.24,23.73 R4.2 | U2.4 39.43,39.81 v39.88,40.26
  Bottom 0.203: v31.24,27.43 31.24,35.05 36.45,40.26 v39.88,40.26
RF_N
  Top 0.254: U1.19 17.33,12.8 B1.3
RF_N2
  Top 0.152: U2.19 39.93,30.31
  Top 0.203: 39.93,30.31 C6.1
RF_P
  Top 0.254: U1.17 16.33,12.8 B1.4
RF_P2
  Top 0.152: 38.95,32.6 38.95,30.39 C3.1
  Top 0.203: U2.17 38.95,32.6
SCL  (via drill 0.41)
  Top 0.203: U3.SCL 6.36,81.92 5.71,81.28 5.71,78.11 v6.99,76.83 | 6.35,72.39 6.99,73.03 v6.99,73.53 | 6.35,72.39 1.02,67.06 1.02,44.7 P9/P8.P9_19 | R10.1 6.35,72.39
  Bottom 0.203: v6.99,76.83 6.99,74.61 6.99,74.3 v6.99,73.53
SCLK  (via drill 0.41)
  Top 0.203: U2.28 41.83,38.53 v43.69,40.39 | U1.28 19.23,19.48 20.32,20.57 20.32,21.84 20.07,22.1 16.76,22.1 9.4,29.46 9.4,37.08 10.16,37.85 v10.16,40.64
  Bottom 0.203: v43.69,40.39 43.69,41.66 43.43,41.91 11.94,41.91 10.67,40.64 v10.16,40.64 9.65,40.64 P9/P8.P9_22
SDA
  Top 0.203: 6.35,74.17 6.35,72.9 0.51,67.06 0.51,43.43 2.03,41.91 3.81,41.91 P9/P8.P9_20 | 6.35,74.17 6.35,76.2 5.08,77.47 5.08,81.92 6.36,83.19 U3.SDA | R11.1 6.86,74.68 6.35,74.17
SFD0  (via drill 0.41)
  Top 0.203: U1.5 16.33,20.5 7.37,29.46 7.37,45.97 v7.62,46.23 | v7.62,49.28 6.1,50.8 P9/P8.P9_14
  Bottom 0.203: v7.62,46.23 v7.62,49.28
SFD1
  Top 0.203: U2.5 38.93,40.46 46.74,48.26 P9/P8.P8_15
VCC  (via drill 0.41)
  Top 0.203: U3.VCC R12.1 | R12.1 7.62,78.49 v7.37,78.23 | R15.2 32.32,19.05 v32.32,17.78
  Top 0.406: L2.2 v33.02,40.13 | R8.2 R7.2 C18.1 9.79,79.06 U3.VCC | R8.2 R11.2 | R8.2 R9.2 R10.2 9.79,71.23 v9.91,71.12 | L1.2 8.13,22.61 v7.87,22.86 | D1.A 41.16,76.95 v40.64,77.47 | D2.A 46.24,76.95 v45.72,77.47 | D3.A 51.32,76.95 v50.8,77.47 | L11.1 33.34,26.42 v33.34,27.56
  pour VCC: 0,0 54.61,0 54.61,86.36 0,86.36
VDD
  Top 0.406: P9/P8.P9_5 P9/P8.P9_6

### Text on the board
tPlace: ZigBeag | N.Jackson | 2014/07/03
tNames: P9 | P8 | GND | GND | 3V3 | 5V | SYS_5V | CCA1 | CCA0 | FIFP1 | SFD0 | FIFO1 | CS1 | SFD1 | LD2 | !RST0 | LD0 | LD1 | CS0 | SO | SDA | SCL | SPICL | SO | FIFP0 | !RESET1 | FIFO0
tDocu: CE1 | RXD | TXD | SCL | SDA